# Altium schematic sheet Sheet2.SCHDOC
size 593 x 439 mm; DocumentNumber: ЕМС.02.00.100 Э3; SheetNumber: 2; SheetTotal: 4; DocumentName: Sheet2.SCHDOC
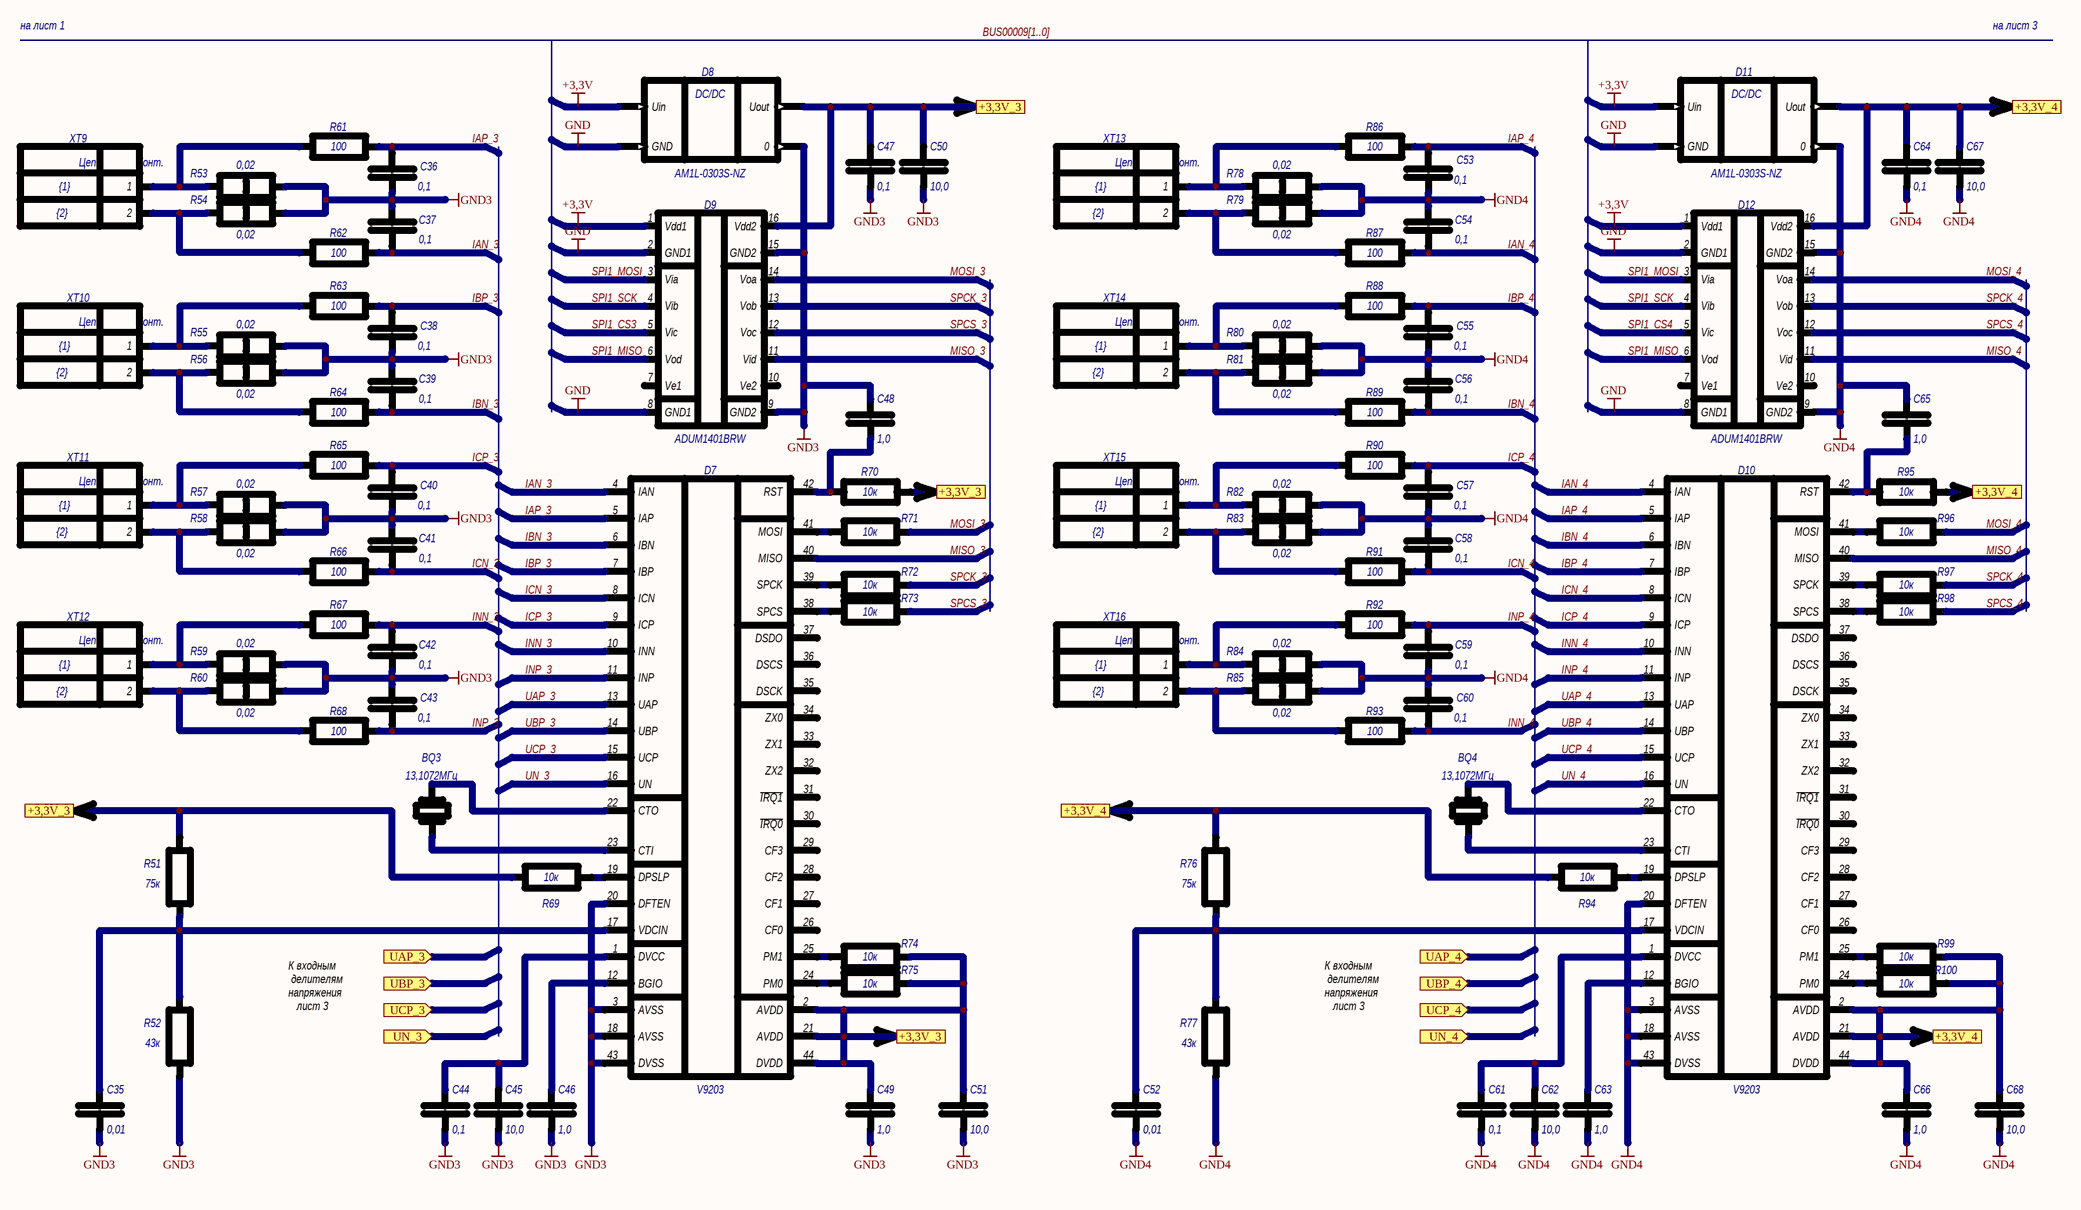
[diagram p0: Sheet2.SCHDOC]

## Parts
BQ3  HC49U-12M  [HC49U]  (value not drawn)
BQ4  HC49U-12M  [HC49U]  (value not drawn)
C35  value 0,01  [0805]  (hidden comment: К0805)
C36  value 0,1  [0805]  (hidden comment: К0805)
C37  value 0,1  [0805]  (hidden comment: К0805)
C38  value 0,1  [0805]  (hidden comment: К0805)
C39  value 0,1  [0805]  (hidden comment: К0805)
C40  value 0,1  [0805]  (hidden comment: К0805)
C41  value 0,1  [0805]  (hidden comment: К0805)
C42  value 0,1  [0805]  (hidden comment: К0805)
C43  value 0,1  [0805]  (hidden comment: К0805)
C44  value 0,1  [0805]  (hidden comment: К0805)
C45  value 10,0  [0805]  (hidden comment: К0805)
C46  value 1,0  [0805]  (hidden comment: К0805)
C47  value 0,1  [0805]  (hidden comment: К0805)
C48  value 1,0  [0805]  (hidden comment: К0805)
C49  value 1,0  [0805]  (hidden comment: К0805)
C50  value 10,0  [0805]  (hidden comment: К0805)
C51  value 10,0  [0805]  (hidden comment: К0805)
C52  value 0,01  [0805]  (hidden comment: К0805)
C53  value 0,1  [0805]  (hidden comment: К0805)
C54  value 0,1  [0805]  (hidden comment: К0805)
C55  value 0,1  [0805]  (hidden comment: К0805)
C56  value 0,1  [0805]  (hidden comment: К0805)
C57  value 0,1  [0805]  (hidden comment: К0805)
C58  value 0,1  [0805]  (hidden comment: К0805)
C59  value 0,1  [0805]  (hidden comment: К0805)
C60  value 0,1  [0805]  (hidden comment: К0805)
C61  value 0,1  [0805]  (hidden comment: К0805)
C62  value 10,0  [0805]  (hidden comment: К0805)
C63  value 1,0  [0805]  (hidden comment: К0805)
C64  value 0,1  [0805]  (hidden comment: К0805)
C65  value 1,0  [0805]  (hidden comment: К0805)
C66  value 1,0  [0805]  (hidden comment: К0805)
C67  value 10,0  [0805]  (hidden comment: К0805)
C68  value 10,0  [0805]  (hidden comment: К0805)
D7  V9203  [TQFP-44]
D8  value AM1L-0303S-NZ  [SIP-4]  (hidden comment: TME0505S)
D9  ADUM1401BRW  [SOL-16]
D10  V9203  [TQFP-44]
D11  value AM1L-0303S-NZ  [SIP-4]  (hidden comment: TME0505S)
D12  ADUM1401BRW  [SOL-16]
R51  Р0805  [0805]  (value not drawn)
R52  Р0805  [0805]  (value not drawn)
R53  value 0,02  [2512]  (hidden comment: Р2512)
R54  value 0,02  [2512]  (hidden comment: Р2512)
R55  value 0,02  [2512]  (hidden comment: Р2512)
R56  value 0,02  [2512]  (hidden comment: Р2512)
R57  value 0,02  [2512]  (hidden comment: Р2512)
R58  value 0,02  [2512]  (hidden comment: Р2512)
R59  value 0,02  [2512]  (hidden comment: Р2512)
R60  value 0,02  [2512]  (hidden comment: Р2512)
R61  value 100  [0805]  (hidden comment: Р0805)
R62  value 100  [0805]  (hidden comment: Р0805)
R63  value 100  [0805]  (hidden comment: Р0805)
R64  value 100  [0805]  (hidden comment: Р0805)
R65  value 100  [0805]  (hidden comment: Р0805)
R66  value 100  [0805]  (hidden comment: Р0805)
R67  value 100  [0805]  (hidden comment: Р0805)
R68  value 100  [0805]  (hidden comment: Р0805)
R69  Р0805  [0805]  (value not drawn)
R70  Р0805  [0805]  (value not drawn)
R71  Р0805  [0805]  (value not drawn)
R72  Р0805  [0805]  (value not drawn)
R73  Р0805  [0805]  (value not drawn)
R74  Р0805  [0805]  (value not drawn)
R75  Р0805  [0805]  (value not drawn)
R76  Р0805  [0805]  (value not drawn)
R77  Р0805  [0805]  (value not drawn)
R78  value 0,02  [2512]  (hidden comment: Р2512)
R79  value 0,02  [2512]  (hidden comment: Р2512)
R80  value 0,02  [2512]  (hidden comment: Р2512)
R81  value 0,02  [2512]  (hidden comment: Р2512)
R82  value 0,02  [2512]  (hidden comment: Р2512)
R83  value 0,02  [2512]  (hidden comment: Р2512)
R84  value 0,02  [2512]  (hidden comment: Р2512)
R85  value 0,02  [2512]  (hidden comment: Р2512)
R86  value 100  [0805]  (hidden comment: Р0805)
R87  value 100  [0805]  (hidden comment: Р0805)
R88  value 100  [0805]  (hidden comment: Р0805)
R89  value 100  [0805]  (hidden comment: Р0805)
R90  value 100  [0805]  (hidden comment: Р0805)
R91  value 100  [0805]  (hidden comment: Р0805)
R92  value 100  [0805]  (hidden comment: Р0805)
R93  value 100  [0805]  (hidden comment: Р0805)
R94  Р0805  [0805]  (value not drawn)
R95  Р0805  [0805]  (value not drawn)
R96  Р0805  [0805]  (value not drawn)
R97  Р0805  [0805]  (value not drawn)
R98  Р0805  [0805]  (value not drawn)
R99  Р0805  [0805]  (value not drawn)
R100  Р0805  [0805]  (value not drawn)
XT9  2: {2}  1: {1}  [EK508V-02P]  (hidden comment: EK508V-02P)
XT10  2: {2}  1: {1}  [EK508V-02P]  (hidden comment: EK508V-02P)
XT11  2: {2}  1: {1}  [EK508V-02P]  (hidden comment: EK508V-02P)
XT12  2: {2}  1: {1}  [EK508V-02P]  (hidden comment: EK508V-02P)
XT13  2: {2}  1: {1}  [EK508V-02P]  (hidden comment: EK508V-02P)
XT14  2: {2}  1: {1}  [EK508V-02P]  (hidden comment: EK508V-02P)
XT15  2: {2}  1: {1}  [EK508V-02P]  (hidden comment: EK508V-02P)
XT16  2: {2}  1: {1}  [EK508V-02P]  (hidden comment: EK508V-02P)

## Ports
+3,3V_3, +3,3V_4, UAP_3 (in), UAP_4 (in), UBP_3 (in), UBP_4 (in), UCP_3 (in), UCP_4 (in), UN_3 (in), UN_4 (in)

## Nets
+3,3V: D8.2(Uin) D9.1(Vdd1) D11.2(Uin) D12.1(Vdd1)
GND: D8.1(GND) D9.2(GND1) D9.8(GND1) D11.1(GND) D12.2(GND1) D12.8(GND1)
GND3: C35.1 C36.2 C37.2 C38.2 C39.2 C40.2 C41.2 C42.1 C43.1 C44.1 C45.1 C46.1 C47.1 C48.2 C49.1 C50.1 C51.1 D7.3(AVSS) D7.18(AVSS) D7.20(DFTEN) D7.43(DVSS) D8.3(0) D9.9(GND2) D9.15(GND2) R52.1 R53.2 R54.2 R55.2 R56.2 R57.2 R58.2 R59.2 R60.2
GND4: C52.1 C53.2 C54.2 C55.2 C56.2 C57.2 C58.2 C59.1 C60.1 C61.1 C62.1 C63.1 C64.1 C65.2 C66.1 C67.1 C68.1 D10.3(AVSS) D10.18(AVSS) D10.20(DFTEN) D10.43(DVSS) D11.3(0) D12.9(GND2) D12.15(GND2) R77.1 R78.2 R79.2 R80.2 R81.2 R82.2 R83.2 R84.2 R85.2
+3,3V_3: C47.2 C49.2 C50.2 C51.2 D7.2(AVDD) D7.21(AVDD) D7.44(DVDD) D8.4(Uout) D9.16(Vdd2) R51.2 R69.2 R70.2 R74.1 R75.1 ; port +3,3V_3
+3,3V_4: C64.2 C66.2 C67.2 C68.2 D10.2(AVDD) D10.21(AVDD) D10.44(DVDD) D11.4(Uout) D12.16(Vdd2) R76.2 R94.2 R95.2 R99.1 R100.1 ; port +3,3V_4
IAN_3: C37.1 D7.4(IAN) R62.1
IAN_4: C54.1 D10.4(IAN) R87.1
IAP_3: C36.1 D7.5(IAP) R61.1
IAP_4: C53.1 D10.5(IAP) R86.1
IBN_3: C39.1 D7.6(IBN) R64.1
IBN_4: C56.1 D10.6(IBN) R89.1
IBP_3: C38.1 D7.7(IBP) R63.1
IBP_4: C55.1 D10.7(IBP) R88.1
ICN_3: C41.1 D7.8(ICN) R66.1
ICN_4: C58.1 D10.8(ICN) R91.1
ICP_3: C40.1 D7.9(ICP) R65.1
ICP_4: C57.1 D10.9(ICP) R90.1
INN_3: C42.2 D7.10(INN) R67.1
INN_4: C60.2 D10.10(INN) R93.1
INP_3: C43.2 D7.11(INP) R68.1
INP_4: C59.2 D10.11(INP) R92.1
MISO_3: D7.40(MISO) D9.11(Vid)
MISO_4: D10.40(MISO) D12.11(Vid)
MOSI_3: D9.14(Voa) R71.1
MOSI_4: D12.14(Voa) R96.1
SPCK_3: D9.13(Vob) R72.1
SPCK_4: D12.13(Vob) R97.1
SPCS_3: D9.12(Voc) R73.1
SPCS_4: D12.12(Voc) R98.1
SPI1_CS3: D9.5(Vic)
SPI1_CS4: D12.5(Vic)
SPI1_MISO: D9.6(Vod) D12.6(Vod)
SPI1_MOSI: D9.3(Via) D12.3(Via)
SPI1_SCK: D9.4(Vib) D12.4(Vib)
UAP_3: D7.13(UAP)
UAP_4: D10.13(UAP)
UBP_3: D7.14(UBP)
UBP_4: D10.14(UBP)
UCP_3: D7.15(UCP)
UCP_4: D10.15(UCP)
UN_3: D7.16(UN)
UN_4: D10.16(UN)
NetBQ3_1: BQ3.1 D7.23(CTI)
NetBQ3_2: BQ3.2 D7.22(CTO)
NetBQ4_1: BQ4.1 D10.23(CTI)
NetBQ4_2: BQ4.2 D10.22(CTO)
NetC35_2: C35.2 D7.17(VDCIN) R51.1 R52.2
NetC44_2: C44.2 C45.2 D7.1(DVCC)
NetC46_2: C46.2 D7.12(BGIO)
NetC48_1: C48.1 D7.42(RST) R70.1
NetC52_2: C52.2 D10.17(VDCIN) R76.1 R77.2
NetC61_2: C61.2 C62.2 D10.1(DVCC)
NetC63_2: C63.2 D10.12(BGIO)
NetC65_1: C65.1 D10.42(RST) R95.1
NetD7_19: D7.19(DPSLP) R69.1
NetD7_24: D7.24(PM0) R75.2
NetD7_25: D7.25(PM1) R74.2
NetD7_38: D7.38(SPCS) R73.2
NetD7_39: D7.39(SPCK) R72.2
NetD7_41: D7.41(MOSI) R71.2
NetD10_19: D10.19(DPSLP) R94.1
NetD10_24: D10.24(PM0) R100.2
NetD10_25: D10.25(PM1) R99.2
NetD10_38: D10.38(SPCS) R98.2
NetD10_39: D10.39(SPCK) R97.2
NetD10_41: D10.41(MOSI) R96.2
NetR53_1: R53.1 R61.2 XT9.1
NetR54_1: R54.1 R62.2 XT9.2
NetR55_1: R55.1 R63.2 XT10.1
NetR56_1: R56.1 R64.2 XT10.2
NetR57_1: R57.1 R65.2 XT11.1
NetR58_1: R58.1 R66.2 XT11.2
NetR59_1: R59.1 R67.2 XT12.1
NetR60_1: R60.1 R68.2 XT12.2
NetR78_1: R78.1 R86.2 XT13.1
NetR79_1: R79.1 R87.2 XT13.2
NetR80_1: R80.1 R88.2 XT14.1
NetR81_1: R81.1 R89.2 XT14.2
NetR82_1: R82.1 R90.2 XT15.1
NetR83_1: R83.1 R91.2 XT15.2
NetR84_1: R84.1 R92.2 XT16.1
NetR85_1: R85.1 R93.2 XT16.2

Not connected (* = marked no-connect by the designer): D7 26(CF0) 27(CF1) 28(CF2) 29(CF3) 30(~{IRQ0}) 31(~{IRQ1}) 32(ZX2) 33(ZX1) 34(ZX0) 35(DSCK) 36(DSCS) 37(DSDO); D9 7(Ve1) 10(Ve2); D10 26(CF0) 27(CF1) 28(CF2) 29(CF3) 30(~{IRQ0}) 31(~{IRQ1}) 32(ZX2) 33(ZX1) 34(ZX0) 35(DSCK) 36(DSCS) 37(DSDO); D12 7(Ve1) 10(Ve2)

## Buses and harness runs
bus BUS00009[1..0]

## Notes on the sheet
- на лист 1
- на лист 3
- К входным
  делителям
  напряжения
  лист 3
- Подп. и дата
- Инв. № дубл.
- Взам. инв. №
- Инв. № подл.
- Лист
- Изм.
- № докум.
- Подп.
- Дата
- (in symbol EK508V-02P) Цепь; Конт.
- (in symbol HC49U-12M) 13,1072МГц
- (in symbol TME0505S) DC/DC
- (in symbol Р0805) 75к; 43к
- (in symbol Р0805_VARIANT_1) 10к

## Library data of the parts
BQ3 BQ4 = HC49U-12M: РЕЗОНАТОР; TG: {TG}; TO: 020, 211/-/12.0М; TU: {TU}; NO: 0524; RefDes2: {RefDes2}; ComponentHeight: {ComponentHeight}
C35-C68 = К0805: КОНДЕНСАТОР; TG: NP0; TO: 5%; TU: {TU}; NO: {NO}; RefDes2: {RefDes2}; ComponentHeight: 1
D7 D10 = V9203: {Description}; TG: {TG}; NO: {NO}; RefDes2: {RefDes2}; TU: {TU}; TO: {TO}; ComponentHeight: {ComponentHeight}
D8 D11 = TME0505S: МИКРОСХЕМА; TO: 320/SIP-4/SZ; TU: TRACO, AIMTEC; NO: 0007; RefDes2: {RefDes2}; ComponentHeight: 10
R51 R52 R76 R77 = Р0805: РЕЗИСТОР; TG: 0,125; TO: 1%; TU: {TU}; NO: {NO}; RefDes2: {RefDes2}; ComponentHeight: 1
R53-R60 R78-R85 = Р2512: РЕЗИСТОР; TG: 1; TO: 5%; TU: {TU}; NO: {NO}; RefDes2: {RefDes2}; ComponentHeight: 1.2
R61-R75 R86-R100 = Р0805_VARIANT_1: РЕЗИСТОР; TG: 0,125; TO: 1%; TU: {TU}; NO: {NO}; RefDes2: {RefDes2}; ComponentHeight: 1
XT9-XT16 = EK508V-02P: {Description}; Value: 5.08; TU: {TU}; TG: {TG}; RefDes2: {RefDes2}; TO: {TO}; NO: {NO}; N1: {N1}; N2: {N2}; ComponentHeight: {ComponentHeight}